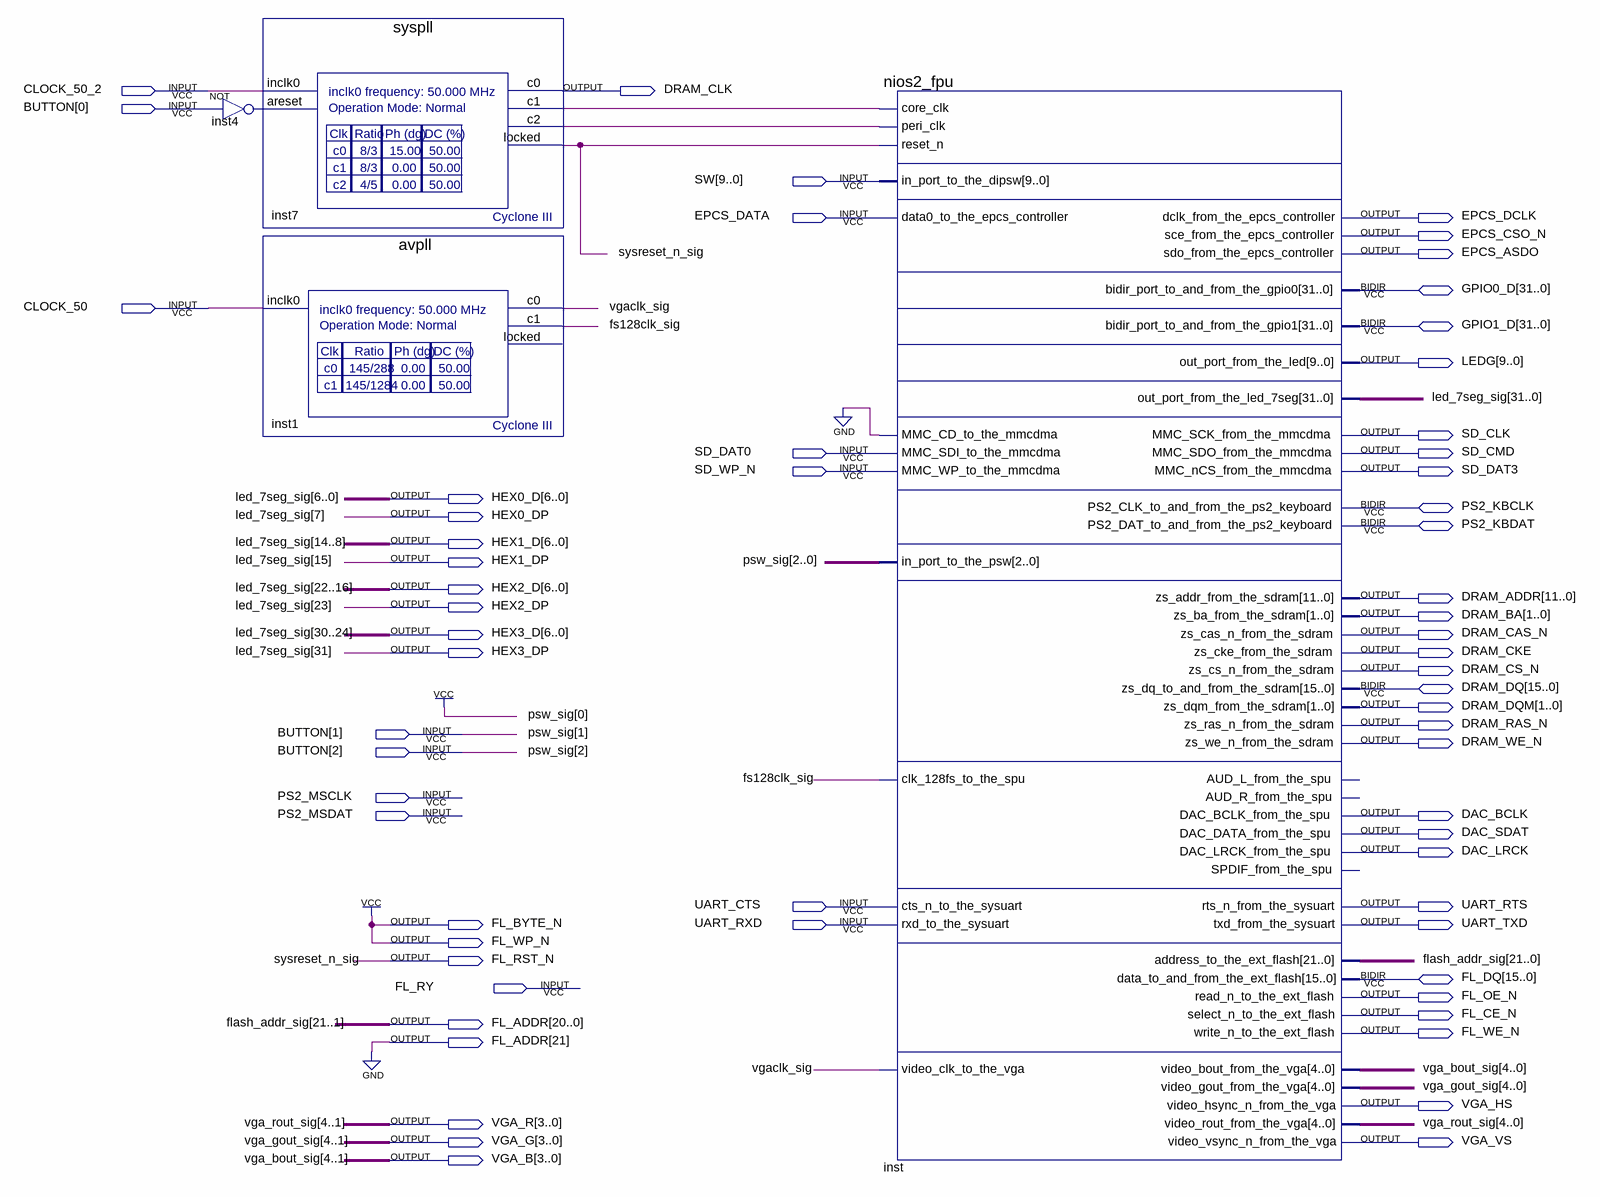
[diagram p0: schematic sheet]
// Quartus schematic cineraria.bdf as structural Verilog: 4 symbols, 62 pins
module cineraria (
  input  CLOCK_50_2,
  input  [2:0] BUTTON,
  input  [9:0] SW,
  input  EPCS_DATA,
  input  CLOCK_50,
  input  SD_DAT0,
  input  SD_WP_N,
  input  PS2_MSCLK,
  input  PS2_MSDAT,
  input  UART_CTS,
  input  UART_RXD,
  input  FL_RY,
  inout  [31:0] GPIO0_D,
  inout  [31:0] GPIO1_D,
  inout  PS2_KBCLK,
  inout  PS2_KBDAT,
  inout  [15:0] DRAM_DQ,
  inout  [15:0] FL_DQ,
  output DRAM_CLK,
  output EPCS_DCLK,
  output EPCS_CSO_N,
  output EPCS_ASDO,
  output [9:0] LEDG,
  output SD_CLK,
  output SD_CMD,
  output SD_DAT3,
  output [6:0] HEX0_D,
  output HEX0_DP,
  output [6:0] HEX1_D,
  output HEX1_DP,
  output [6:0] HEX2_D,
  output [11:0] DRAM_ADDR,
  output HEX2_DP,
  output [1:0] DRAM_BA,
  output [6:0] HEX3_D,
  output DRAM_CAS_N,
  output HEX3_DP,
  output DRAM_CKE,
  output DRAM_CS_N,
  output [1:0] DRAM_DQM,
  output DRAM_RAS_N,
  output DRAM_WE_N,
  output DAC_BCLK,
  output DAC_SDAT,
  output DAC_LRCK,
  output UART_RTS,
  output FL_BYTE_N,
  output UART_TXD,
  output FL_WP_N,
  output FL_RST_N,
  output FL_OE_N,
  output FL_CE_N,
  output [21:0] FL_ADDR,
  output FL_WE_N,
  output VGA_HS,
  output [3:0] VGA_R,
  output [3:0] VGA_G,
  output VGA_VS,
  output [3:0] VGA_B
);

  wire fs128clk_sig, inst4_out, inst7_c1, inst7_c2, vgaclk_sig;
  wire [0:0] flash_addr_sig, vga_bout_sig, vga_gout_sig, vga_rout_sig;

  not inst4 (inst4_out, BUTTON[0]);
  syspll inst7 (
    .inclk0(CLOCK_50_2), .areset(inst4_out), .c0(DRAM_CLK), .c1(inst7_c1), .c2(inst7_c2), .locked(FL_RST_N));
  avpll inst1 (.inclk0(CLOCK_50), .c0(vgaclk_sig), .c1(fs128clk_sig));  // open: locked
  nios2_fpu inst (
    .core_clk(inst7_c1), .peri_clk(inst7_c2), .reset_n(FL_RST_N), .in_port_to_the_dipsw(SW),
    .data0_to_the_epcs_controller(EPCS_DATA), .MMC_CD_to_the_mmcdma(1'b0), .MMC_SDI_to_the_mmcdma(SD_DAT0),
    .MMC_WP_to_the_mmcdma(SD_WP_N), .in_port_to_the_psw({BUTTON[2:1], 1'b1}),
    .clk_128fs_to_the_spu(fs128clk_sig), .cts_n_to_the_sysuart(UART_CTS), .rxd_to_the_sysuart(UART_RXD),
    .video_clk_to_the_vga(vgaclk_sig), .dclk_from_the_epcs_controller(EPCS_DCLK),
    .sce_from_the_epcs_controller(EPCS_CSO_N), .sdo_from_the_epcs_controller(EPCS_ASDO),
    .out_port_from_the_led(LEDG),
    .out_port_from_the_led_7seg({HEX3_DP, HEX3_D, HEX2_DP, HEX2_D, HEX1_DP, HEX1_D, HEX0_DP, HEX0_D}),
    .MMC_SCK_from_the_mmcdma(SD_CLK), .MMC_SDO_from_the_mmcdma(SD_CMD), .MMC_nCS_from_the_mmcdma(SD_DAT3),
    .zs_addr_from_the_sdram(DRAM_ADDR), .zs_ba_from_the_sdram(DRAM_BA), .zs_cas_n_from_the_sdram(DRAM_CAS_N),
    .zs_cke_from_the_sdram(DRAM_CKE), .zs_cs_n_from_the_sdram(DRAM_CS_N), .zs_dqm_from_the_sdram(DRAM_DQM),
    .zs_ras_n_from_the_sdram(DRAM_RAS_N), .zs_we_n_from_the_sdram(DRAM_WE_N),
    .DAC_BCLK_from_the_spu(DAC_BCLK), .DAC_DATA_from_the_spu(DAC_SDAT), .DAC_LRCK_from_the_spu(DAC_LRCK),
    .rts_n_from_the_sysuart(UART_RTS), .txd_from_the_sysuart(UART_TXD),
    .address_to_the_ext_flash({FL_ADDR[20:0], flash_addr_sig[0]}), .read_n_to_the_ext_flash(FL_OE_N),
    .select_n_to_the_ext_flash(FL_CE_N), .write_n_to_the_ext_flash(FL_WE_N),
    .video_bout_from_the_vga({VGA_B, vga_bout_sig[0]}), .video_gout_from_the_vga({VGA_G, vga_gout_sig[0]}),
    .video_hsync_n_from_the_vga(VGA_HS), .video_rout_from_the_vga({VGA_R, vga_rout_sig[0]}),
    .video_vsync_n_from_the_vga(VGA_VS), .bidir_port_to_and_from_the_gpio0(GPIO0_D),
    .bidir_port_to_and_from_the_gpio1(GPIO1_D), .PS2_CLK_to_and_from_the_ps2_keyboard(PS2_KBCLK),
    .PS2_DAT_to_and_from_the_ps2_keyboard(PS2_KBDAT), .zs_dq_to_and_from_the_sdram(DRAM_DQ),
    .data_to_and_from_the_ext_flash(FL_DQ));  // open: AUD_L_from_the_spu, AUD_R_from_the_spu, SPDIF_from_the_spu

  assign FL_ADDR[21] = 1'b0;
  assign FL_BYTE_N = 1'b1;
  assign FL_WP_N = 1'b1;

  // Other names for the same wires on the sheet: flash_addr_sig[21:1] = FL_ADDR[20:0];
  //   led_7seg_sig[31:0] = {HEX3_DP, HEX3_D, HEX2_DP, HEX2_D, HEX1_DP, HEX1_D, HEX0_DP, HEX0_D};
  //   psw_sig[2:1] = BUTTON[2:1]; sysreset_n_sig = FL_RST_N; vga_bout_sig[4:1] = VGA_B; vga_gout_sig[4:1] = VGA_G;
  //   vga_rout_sig[4:1] = VGA_R
endmodule
